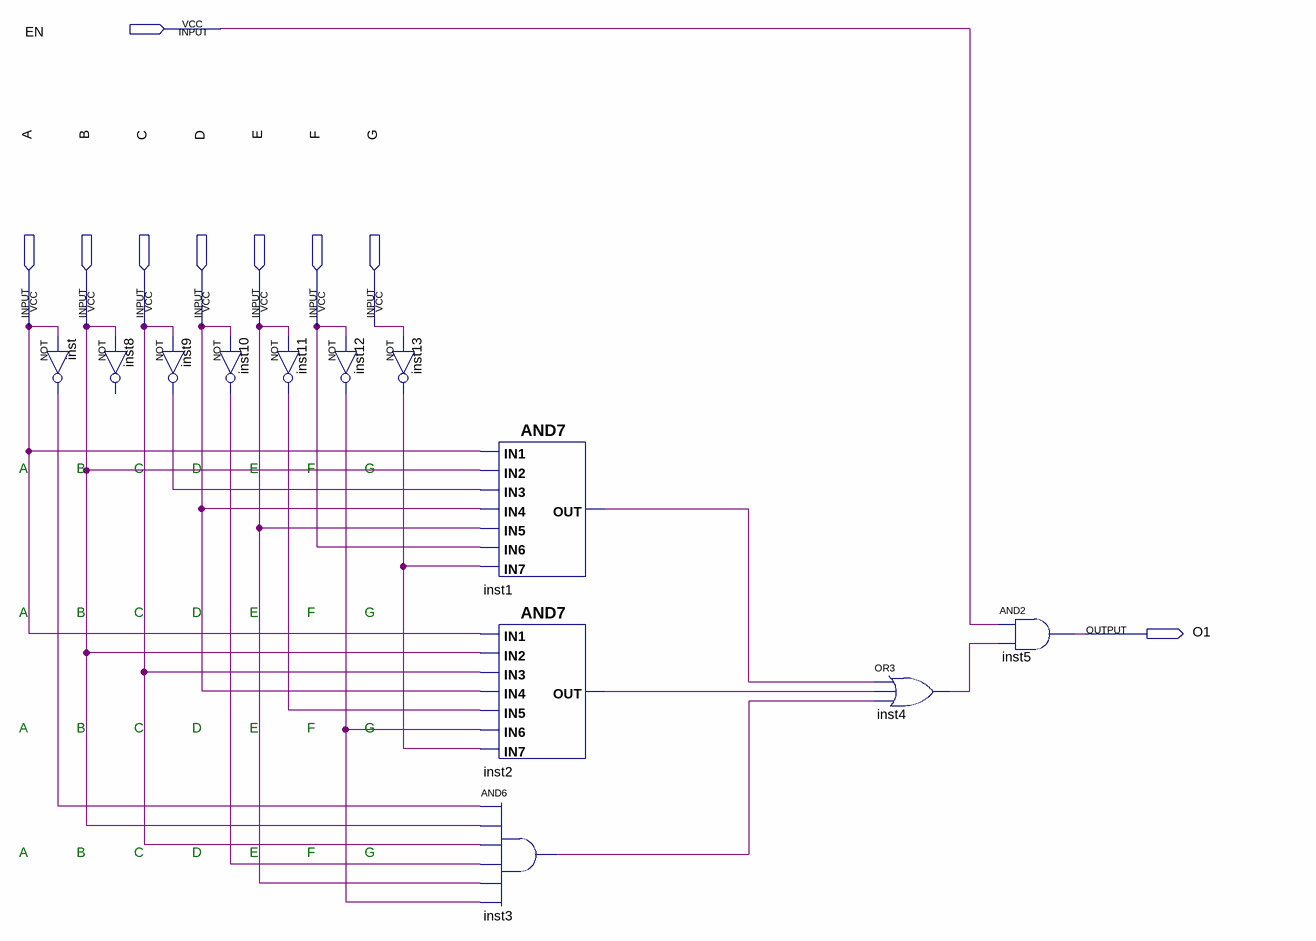
[diagram p0: schematic sheet]
// Quartus schematic linha3led2.bdf as structural Verilog: 12 symbols, 9 pins
module linha3led2 (
  input  EN,
  input  A,
  input  B,
  input  C,
  input  D,
  input  E,
  input  F,
  input  G,
  output O1
);

  wire inst1_out, inst2_out, inst3_out, inst4_out, inst9_out, inst10_out, inst11_out, inst12_out, inst13_out,
       inst_out;

  not inst (inst_out, A);
  // NOT inst8 has open pins: IN=B, OUT=open
  not inst9 (inst9_out, C);
  not inst10 (inst10_out, D);
  not inst11 (inst11_out, E);
  not inst12 (inst12_out, F);
  not inst13 (inst13_out, G);
  and inst1 (inst1_out, A, B, inst9_out, D, E, F, inst13_out);
  and inst2 (inst2_out, A, B, C, D, inst11_out, inst12_out, inst13_out);
  and inst3 (inst3_out, inst_out, B, C, inst10_out, E, inst12_out);
  or inst4 (inst4_out, inst1_out, inst2_out, inst3_out);
  and inst5 (O1, EN, inst4_out);

  // Notes on the sheet:
  //   A
  //   B
  //   C
  //   D
  //   E
  //   F
  //   G
  //   A
  //   B
  //   C
  //   D
  //   E
  //   F
  //   G
  //   A
  //   B
  //   C
  //   D
  //   E
  //   F
  //   G
  //   A
  //   B
  //   C
  //   D
  //   E
  //   F
  //   G
endmodule
